# Altium schematic sheet USB-SATA.schdoc
size 431 x 309 mm; Symbol: Sheet-Symbol_A3; Device: Sheet-Symbol_A3; Company: 嘉立创EDA; @Project Name: 基于ASM1153E的TYPEC接口的MSATA硬盘盒子; @Page Count: 1; @Update Date: 2022-11-05; @Create Date: 2022-11-05; @Schematic Name: Schematic1_2; @Page No: 1; @Page Name: P1; @Board Name: 5MM版本外壳/新版，修复typec不供电; @Create Time: 11:38:27; @Update Time: 12:36:54
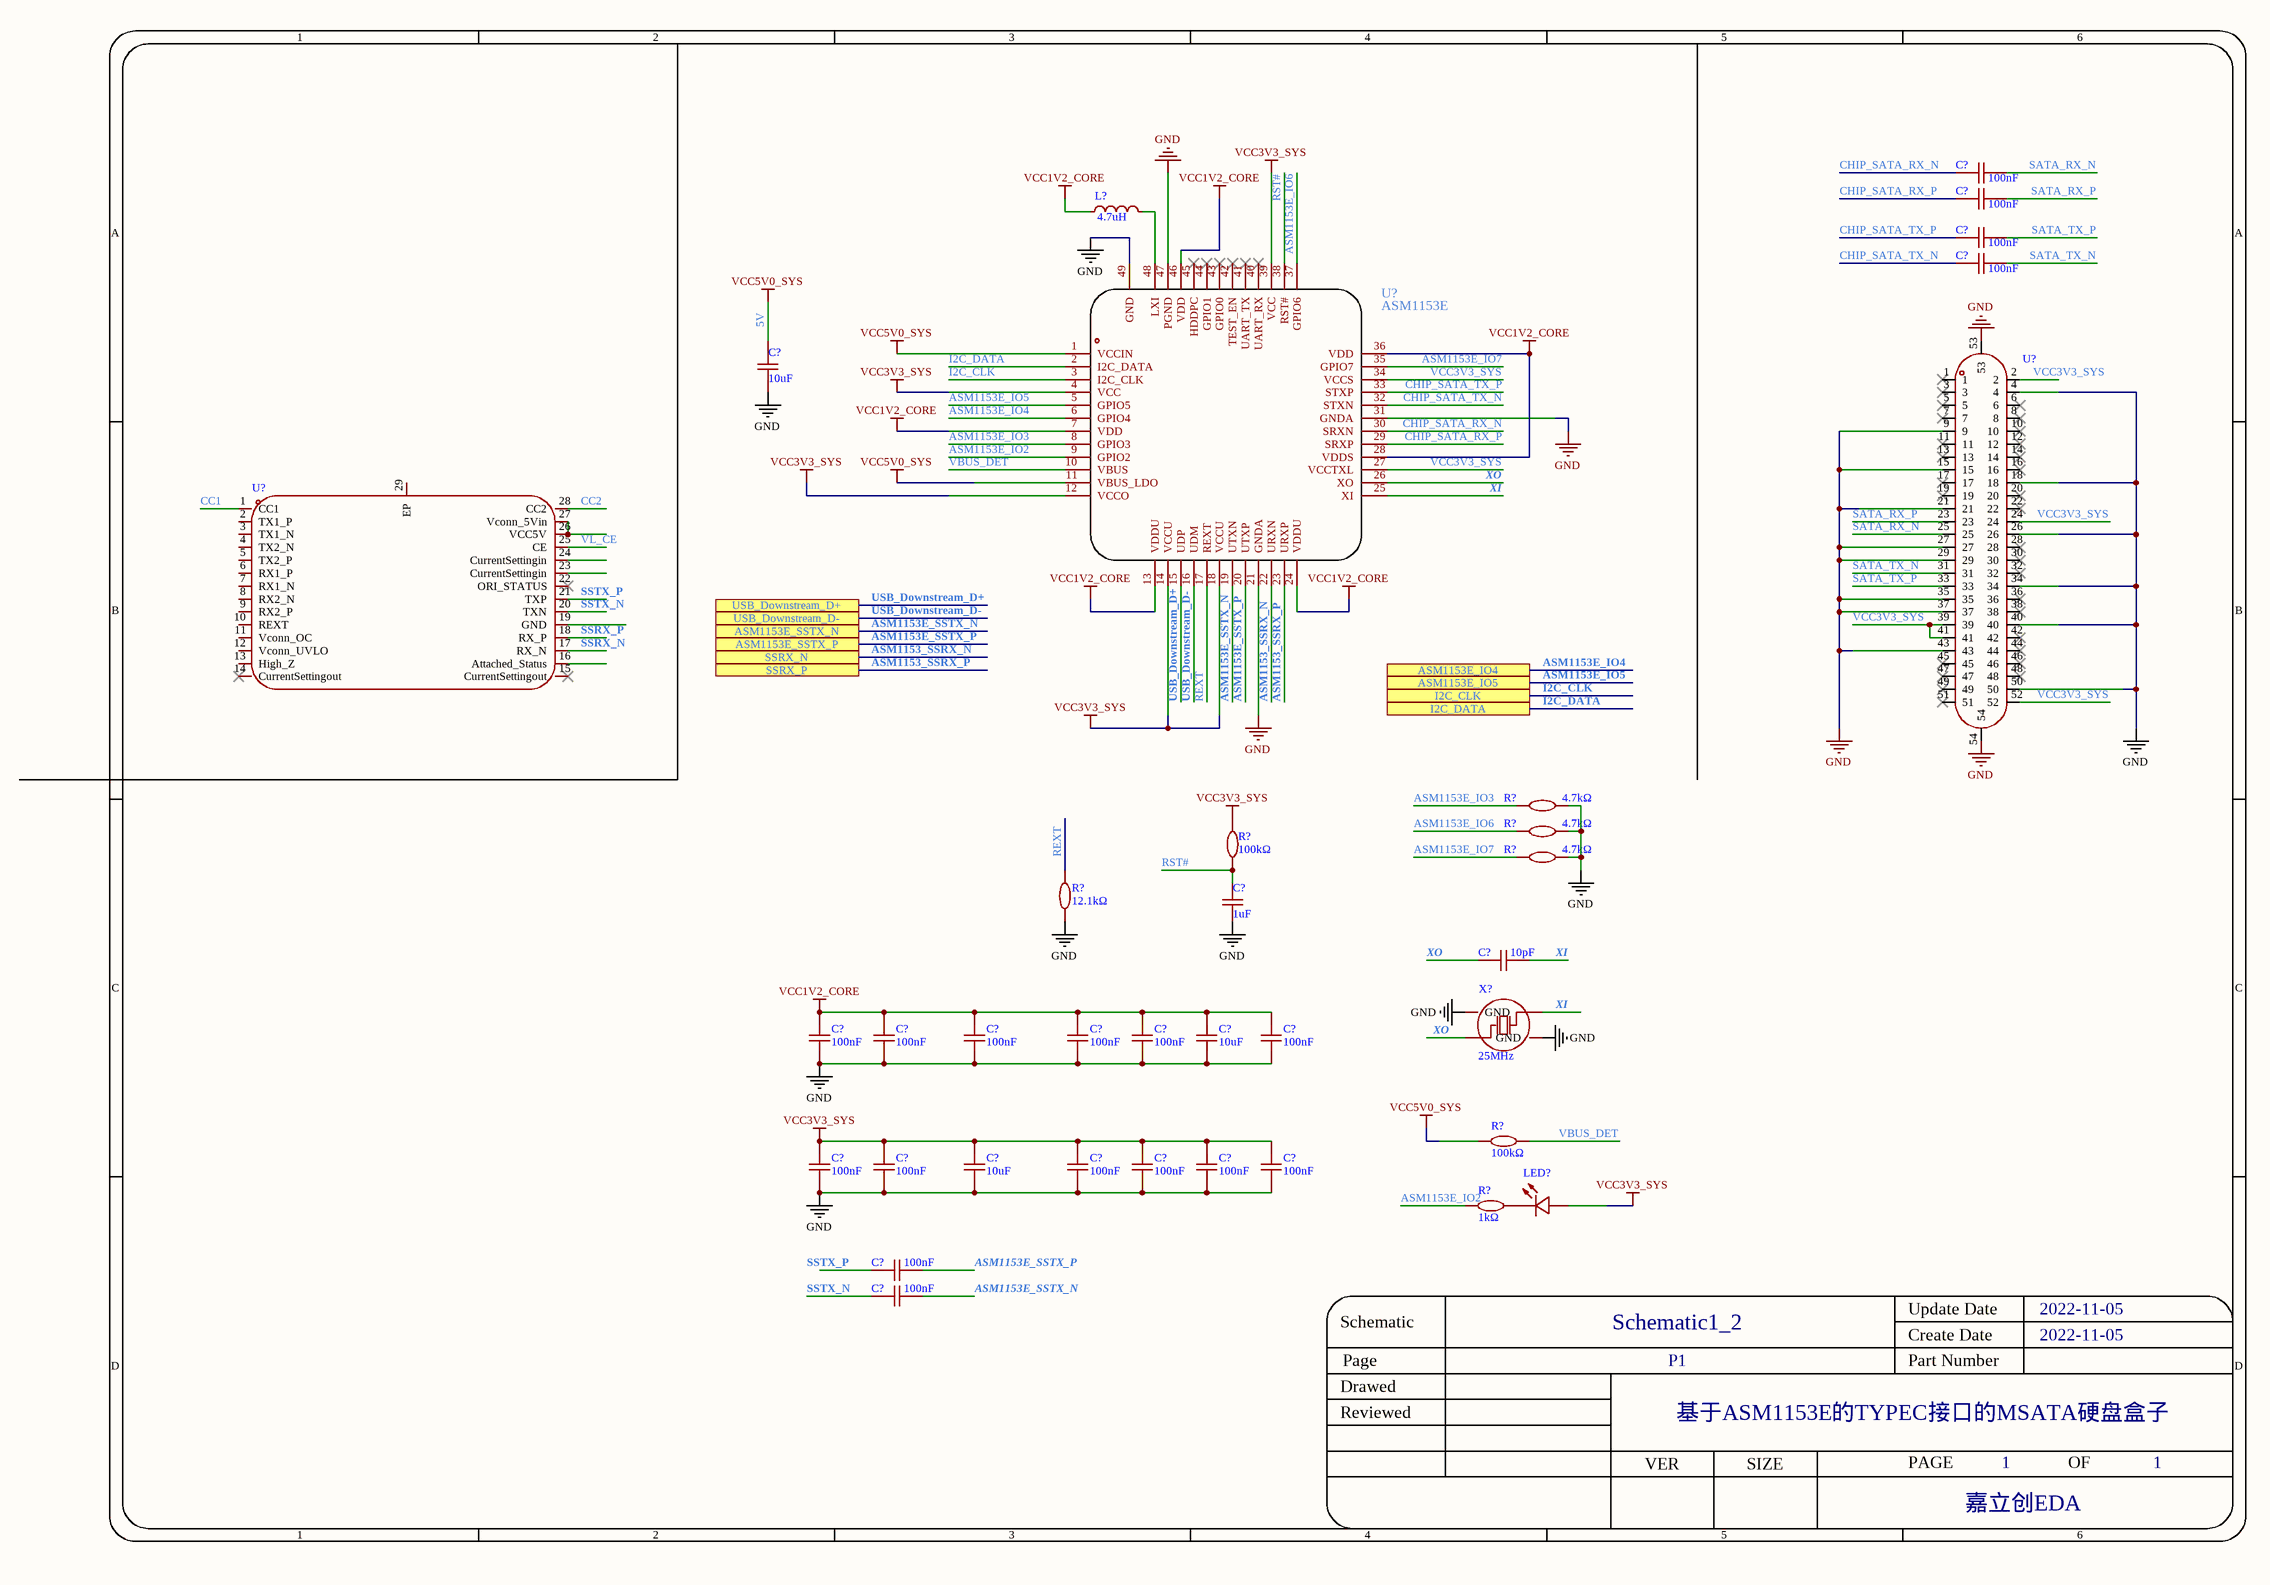
[diagram p0: USB-SATA.schdoc]

## Parts
(Parts that share a designator on the sheet are numbered #1, #2 ... from top to bottom, then left to right.)
C?#1  100nF  [C0402]
C?#2  100nF  [C0402]
C?#3  100nF  [C0402]
C?#4  100nF  [C0402]
C?#5  10uF  [C0603]
C?#6  1uF  [C0402]
C?#7  10pF  [C0402]
C?#8  100nF  [C0402]
C?#9  100nF  [C0402]
C?#10  100nF  [C0402]
C?#11  100nF  [C0402]
C?#12  100nF  [C0402]
C?#13  10uF  [C0603]
C?#14  100nF  [C0402]
C?#15  100nF  [C0402]
C?#16  100nF  [C0402]
C?#17  10uF  [C0603]
C?#18  100nF  [C0402]
C?#19  100nF  [C0402]
C?#20  100nF  [C0402]
C?#21  100nF  [C0402]
C?#22  100nF  [C0402]
C?#23  100nF  [C0402]
L?  4.7uH  [IND-SMD_L3.0-W3.0-1]
LED?  VLMW1500-GS08  [LED0402-R-RD_WHITE]  (value not drawn)
R?#1  4.7kΩ  [R0402]
R?#2  4.7kΩ  [R0402]
R?#3  100kΩ  [R0402]
R?#4  4.7kΩ  [R0402]
R?#5  12.1kΩ  [R0402]
R?#6  100kΩ  [R0402]
R?#7  1kΩ  [R0402]
U?#1  PCIE-52P70H  [PCIE-SMD_52P-P0.80_PCIE-52PXXH]  (value not drawn)
U?#2  ASM1153E  [QFN-48_L6.0-W6.0-P0.40-BL-EP4.2]
U?#3  VL160  [MQFN-28_L4.5-W3.5-P0.40-BL-EP]  (value not drawn)
X?  25MHz  [CRYSTAL-SMD_4P-L3.2-W2.5-BL]

## Ports
ASM1153E_IO4, ASM1153E_IO5, ASM1153E_SSTX_N, ASM1153E_SSTX_P, I2C_CLK, I2C_DATA, SSRX_N, SSRX_P, USB_Downstream_D+, USB_Downstream_D-

## Nets
5V: C?#5.2 R?#6.1 U?#2.1(VCCIN) U?#2.11(VBUS_LDO)  [also labelled VCC5V0_SYS]
GND: C?#5.1 C?#6.1 C?#8.2 C?#9.2 C?#10.2 C?#11.2 C?#12.2 C?#13.2 C?#14.1 C?#15.2 C?#16.2 C?#17.1 C?#18.2 C?#19.2 C?#20.2 C?#21.2 R?#1.2 R?#2.2 R?#4.2 R?#5.1 U?#1.4 U?#1.9 U?#1.15 U?#1.18 U?#1.21 U?#1.26 U?#1.27 U?#1.29 U?#1.34 U?#1.35 U?#1.37 U?#1.40 U?#1.43 U?#1.50 U?#1.53 U?#1.54 U?#2.21(GNDA) U?#2.31(GNDA) U?#2.47(PGND) U?#2.49(GND) X?.2(GND) X?.4(GND)
VCC1V2_CORE: C?#8.1 C?#9.1 C?#10.1 C?#11.1 C?#12.1 C?#13.1 C?#14.2 L?.1 U?#2.7(VDD) U?#2.13(VDDU) U?#2.24(VDDU) U?#2.28(VDDS) U?#2.36(VDD) U?#2.46(VDD)
VCC3V3_SYS: C?#15.1 C?#16.1 C?#17.2 C?#18.1 C?#19.1 C?#20.1 C?#21.1 LED?.1(A) R?#3.2 U?#1.2 U?#1.24 U?#1.39 U?#1.41 U?#1.52 U?#2.4(VCC) U?#2.12(VCCO) U?#2.14(VCCU) U?#2.18(VCCU) U?#2.27(VCCTXL) U?#2.34(VCCS) U?#2.39(VCC)
ASM1153_SSRX_N: U?#2.22(URXN) ; port SSRX_N
ASM1153_SSRX_P: U?#2.23(URXP) ; port SSRX_P
ASM1153E_IO2: R?#7.1 U?#2.9(GPIO2)
ASM1153E_IO3: R?#1.1 U?#2.8(GPIO3)
ASM1153E_IO4: U?#2.6(GPIO4) ; port ASM1153E_IO4
ASM1153E_IO5: U?#2.5(GPIO5) ; port ASM1153E_IO5
ASM1153E_IO6: R?#2.1 U?#2.37(GPIO6)
ASM1153E_IO7: R?#4.1 U?#2.35(GPIO7)
ASM1153E_SSTX_N: C?#23.1 U?#2.19(UTXN) ; port ASM1153E_SSTX_N
ASM1153E_SSTX_P: C?#22.1 U?#2.20(UTXP) ; port ASM1153E_SSTX_P
CC1: U?#3.1(CC1)
CC2: U?#3.28(CC2)
CHIP_SATA_RX_N: C?#1.1 U?#2.30(SRXN)
CHIP_SATA_RX_P: C?#2.1 U?#2.29(SRXP)
CHIP_SATA_TX_N: C?#4.1 U?#2.32(STXN)
CHIP_SATA_TX_P: C?#3.1 U?#2.33(STXP)
I2C_CLK: U?#2.3(I2C_CLK) ; port I2C_CLK
I2C_DATA: U?#2.2(I2C_DATA) ; port I2C_DATA
REXT: R?#5.2 U?#2.17(REXT)
RST#: C?#6.2 R?#3.1 U?#2.38(RST#)
SATA_RX_N: C?#1.2 U?#1.25
SATA_RX_P: C?#2.2 U?#1.23
SATA_TX_N: C?#4.2 U?#1.31
SATA_TX_P: C?#3.2 U?#1.33
SSRX_N: U?#3.17(RX_N)
SSRX_P: U?#3.18(RX_P)
SSTX_N: C?#23.2 U?#3.20(TXN)
SSTX_P: U?#3.21(TXP)
USB_Downstream_D+: U?#2.15(UDP) ; port USB_Downstream_D+
USB_Downstream_D-: U?#2.16(UDM) ; port USB_Downstream_D-
VBUS_DET: R?#6.2 U?#2.10(VBUS)
VL_CE: U?#3.25(CE)
XI: C?#7.2 U?#2.25(XI) X?.3(OSC2)
XO: C?#7.1 U?#2.26(XO) X?.1(OSC1)
NetL?_2: L?.2 U?#2.48(LXI)
NetLED?_2: LED?.2(K) R?#7.2
NetU?#3_26: U?#3.26(VCC5V) U?#3.27(Vconn_5Vin)

Not connected (* = marked no-connect by the designer): C?#22 2; U?#1 1* 3* 5* 6* 7* 8* 10* 11* 12* 13* 14* 16* 17* 19* 20* 22* 28* 30* 32* 36* 38* 42* 44* 45* 46* 47* 48* 49* 51*; U?#2 40(UART_RX)* 41(UART_TX)* 42(TEST_EN)* 43(GPIO0)* 44(GPIO1)* 45(HDDPC)*; U?#3 2(TX1_P) 3(TX1_N) 4(TX2_N) 5(TX2_P) 6(RX1_P) 7(RX1_N) 8(RX2_N) 9(RX2_P) 10(REXT) 11(Vconn_OC) 12(Vconn_UVLO) 13(High_Z) 14(CurrentSettingout)* 15(CurrentSettingout)* 16(Attached_Status) 19(GND) 22(ORI_STATUS)* 23(CurrentSettingin) 24(CurrentSettingin) 29(EP)

## Notes on the sheet
- Labels drawn without touching a wire or pin: SSTX_P
- 1
- 2
- 3
- 4
- 5
- 6
- A
- B
- C
- Schematic
- Schematic1_2
- Create Date
- Update Date
- 2022-11-05
- D
- Reviewed
- Drawed
- Page
- P1
- Part Number
- 基于ASM1153E的TYPEC接口的MSATA硬盘盒子
- VER
- SIZE
- PAGE
- OF
- 嘉立创EDA

## Library data of the parts
C?#1-C?#4 C?#8-C?#12 C?#14-C?#16 C?#18-C?#23 = TCC0402X5R104M250AT: Manufacturer: CCTC(三环); Add into BOM: yes; Tolerance: ±20%; Voltage Rated: 25V; Temperature Coefficient: X5R; Symbol: TCC0402X5R104M250AT; Device: TCC0402X5R104M250AT; LCSC Part Name: 100nF ±20% 25V; Supplier Part: C359190; Manufacturer Part: TCC0402X5R104M250AT; Supplier Footprint: 0402; JLCPCB Part Class: Extended Part; Datasheet: https://atta.szlcsc.com/upload/public/pdf/source/20190103/C359190_40860758378AF13613616C0AB9EED028.pdf; Supplier: LCSC; Convert to PCB: yes; Value: 100nF
C?#5 C?#13 C?#17 = CL10A106KP8NNNC: Manufacturer: SAMSUNG(三星); Add into BOM: yes; Tolerance: ±10%; Voltage Rated: 10V; Temperature Coefficient: X5R; Symbol: CL10A106KP8NNNC; Device: CL10A106KP8NNNC; LCSC Part Name: 10uF ±10% 10V; Supplier Part: C19702; Manufacturer Part: CL10A106KP8NNNC; Supplier Footprint: 0603; JLCPCB Part Class: Basic Part; Datasheet: https://atta.szlcsc.com/upload/public/pdf/source/20160103/1457707703378.pdf; Supplier: LCSC; Convert to PCB: yes; Value: 10uF
C?#6 = CL05A105KP5NNNC: Manufacturer: SAMSUNG(三星); Add into BOM: yes; Tolerance: ±10%; Voltage Rated: 10V; Temperature Coefficient: X5R; Symbol: CL05A105KP5NNNC; Device: CL05A105KP5NNNC; LCSC Part Name: 1uF ±10% 10V; Supplier Part: C14445; Manufacturer Part: CL05A105KP5NNNC; Supplier Footprint: 0402; JLCPCB Part Class: Extended Part; Datasheet: https://atta.szlcsc.com/upload/public/pdf/source/20160103/1457707670698.pdf; Supplier: LCSC; Convert to PCB: yes; Value: 1uF
C?#7 = TCC0402COG100J500AT: Manufacturer: CCTC(三环); Add into BOM: yes; Tolerance: ±5%; Voltage Rated: 50V; Temperature Coefficient: C0G; Symbol: TCC0402COG100J500AT; Device: TCC0402COG100J500AT; LCSC Part Name: 10pF ±5% 50V; Supplier Part: C696913; Manufacturer Part: TCC0402COG100J500AT; Supplier Footprint: 0402; JLCPCB Part Class: Extended Part; Datasheet: https://atta.szlcsc.com/upload/public/pdf/source/20200707/C696841_89A2C111301AB76AE7642008585E7A11.pdf; Supplier: LCSC; Convert to PCB: yes; Value: 10pF
L? = CKCS3012-4.7uH/M: Manufacturer: CENKER(岑科); Add into BOM: yes; Tolerance: ±20%; Rated Current: 1.24A; DC Resistance (DCR): 120mΩ; Symbol: CKCS3012-4.7UH/M; Device: CKCS3012-4.7uH/M; LCSC Part Name: 4.7uH ±20% 1.24A 120mΩ; Supplier Part: C354557; Manufacturer Part: CKCS3012-4.7uH/M; Supplier Footprint: SMD; JLCPCB Part Class: Extended Part; Datasheet: https://atta.szlcsc.com/upload/public/pdf/source/20190115/C354557_61A3705615E4FADB9C94D2137EE09B6B.pdf; Supplier: LCSC; Convert to PCB: yes; Value: 4.7uH
LED? = VLMW1500-GS08: Manufacturer: VISHAY(威世); Add into BOM: yes; Emitted Color: 白灯; Forward Current: 5mA; Forward Voltage (VF): 2.9V; Luminous Intensity: 90mcd; Power Dissipation: 70mW; Symbol: VLMW1500-GS08; Device: VLMW1500-GS08; LCSC Part Name: 白灯; Supplier Part: C511379; Manufacturer Part: VLMW1500-GS08; Supplier Footprint: 0402; JLCPCB Part Class: Extended Part; Datasheet: https://atta.szlcsc.com/upload/public/pdf/source/20200408/C511379_C2F59698F604A60E2C48FD851172BBA0.pdf; Supplier: LCSC; Convert to PCB: yes; Diode Configuration: -; Lens Color: -; Dominant Wavelength: -; Peak Wavelength: -; Color Temperature: -; Luminous Flux (@25℃): -; Viewing Angle: -; Mounting Sytle: -; Operating Temperature: -30~+80
R?#1 R?#2 R?#4 = 0402WGJ0472TCE: Manufacturer: UNI-ROYAL(厚声); Add into BOM: yes; Tolerance: ±5%; Power(Watts): 1/16W; Temperature Coefficient: ±100ppm/; Overload Voltage (Max): 50V; Symbol: 0402WGJ0472TCE; Device: 0402WGJ0472TCE; LCSC Part Name: 4.7kΩ ±5%; Supplier Part: C25940; Manufacturer Part: 0402WGJ0472TCE; Supplier Footprint: 0402; JLCPCB Part Class: Extended Part; Datasheet: https://atta.szlcsc.com/upload/public/pdf/source/20200306/C422600_1E6D84923E4A46A82E41ADD87F860B5C.pdf; Supplier: LCSC; Convert to PCB: yes; Type: 厚膜电阻; Value: 4.7kΩ; Operating Temperature Range: -55~+155
R?#3 R?#6 = CR0402JF0104G: Manufacturer: LIZ(丽智电子); Add into BOM: yes; Tolerance: ±5%; Power(Watts): 62.5mW; Temperature Coefficient: ±200ppm/; Overload Voltage (Max): 50V; Symbol: CR0402JF0104G; Device: CR0402JF0104G; LCSC Part Name: 100kΩ ±5% 62.5mW; Supplier Part: C100573; Manufacturer Part: CR0402JF0104G; Supplier Footprint: 0402; JLCPCB Part Class: Extended Part; Datasheet: https://atta.szlcsc.com/upload/public/pdf/source/20170408/1491631220702.pdf; Supplier: LCSC; Convert to PCB: yes; Type: 厚膜电阻; Value: 100kΩ; Operating Temperature Range: -55~+125
R?#5 = RC-02W1212FT: Manufacturer: FH(风华); Add into BOM: yes; Tolerance: ±1%; Power(Watts): 62.5mW; Temperature Coefficient: ±200ppm/; Overload Voltage (Max): 50V; Symbol: RC-02W1212FT; Device: RC-02W1212FT; LCSC Part Name: 12.1kΩ ±1% 62.5mW; Supplier Part: C321280; Manufacturer Part: RC-02W1212FT; Supplier Footprint: 0402; JLCPCB Part Class: Extended Part; Datasheet: https://atta.szlcsc.com/upload/public/pdf/source/20181129/C321280_9F126374E01D2C505D3C2BDB1D16BD85.pdf; Supplier: LCSC; Convert to PCB: yes; Value: 12.1kΩ; Operating Temperature Range: -55~+155
R?#7 = RC-02K102JT: Manufacturer: FH(风华); Symbol: RS-02K102JT; Add into BOM: yes; Tolerance: ±5%; Power(Watts): 62.5mW; Temperature Coefficient: ±100ppm/; Overload Voltage (Max): 50V; Device: RC-02K102JT; LCSC Part Name: 1kΩ ±5% 62.5mW; Supplier Part: C140196; Manufacturer Part: RC-02K102JT; Supplier Footprint: 0402; JLCPCB Part Class: Extended Part; Datasheet: https://atta.szlcsc.com/upload/public/pdf/source/20171106/C140196_15099446043381092285.pdf; Supplier: LCSC; Convert to PCB: yes; Value: 1kΩ; Operating Temperature Range: -55~+155
U?#1 = PCIE-52P70H: Manufacturer: XUNPU(讯普); Symbol: PCIE-52P70H_C2982554; Add into BOM: yes; Device: PCIE-52P70H; LCSC Part Name: PCIE-52P70H; Supplier Part: C2982554; Manufacturer Part: PCIE-52P70H; Supplier Footprint: SMD; JLCPCB Part Class: Extended Part; Datasheet: https://atta.szlcsc.com/upload/public/pdf/source/20220311/DC8B167F9A8E29C645B8AA97E9059897.pdf; Supplier: LCSC; Convert to PCB: yes
U?#2 = ASM1153E: USB3.0 to SATA Bridge Controller; Add into BOM: yes; Symbol: ASM1153E; Device: ASM1153E; LCSC Part Name: ASM1153E; Supplier Part: C2762919; Manufacturer Part: ASM1153E; Supplier Footprint: LQFN-48_EP_6.0x6.0x0.4P; JLCPCB Part Class: Extended Part; Datasheet: 2021-03-22/601605W/2276bd4a79cf4165b237c0c17b58d9ef/ASM1153Datasheetv1_1.pdf; Supplier: LCSC; Convert to PCB: yes
U?#3 = VL160: Add into BOM: yes; Symbol: VL160; Device: VL160; LCSC Part Name: VL160; Supplier Part: C2841472; Manufacturer Part: VL160; Supplier Footprint: MQFN-28; JLCPCB Part Class: Extended Part; Datasheet: https://atta.szlcsc.com/upload/public/pdf/source/20210707/C2841472_23203D4DC0B460F77735B81667EEBB6C.pdf; Supplier: LCSC; Convert to PCB: yes; Type: -; Protocol: -; Number of Drivers/Receivers: -; Data Rate: -; Supply Voltage: -
X? = X1E0000210621: Manufacturer: EPSON(爱普生); Add into BOM: yes; Crystal Type: 贴片无源晶振; Frequency Tolerance: ±10ppm; Load Capacitance: 9pF; Equivalent Series Resistance (ESR): 40Ω; Symbol: X1E0000210621; Device: X1E0000210621; LCSC Part Name: 25MHz ±10ppm 9pF; Supplier Part: C255920; Manufacturer Part: X1E0000210621; Supplier Footprint: SMD3225-4P; JLCPCB Part Class: Extended Part; Datasheet: https://atta.szlcsc.com/upload/public/pdf/source/20180822/C255920_F9528E19433D1B377CB88CCBF483E490.pdf; Supplier: LCSC; Convert to PCB: yes; Value: 25MHz; Frequency Stability: -; Operating Temperature: -40~+85